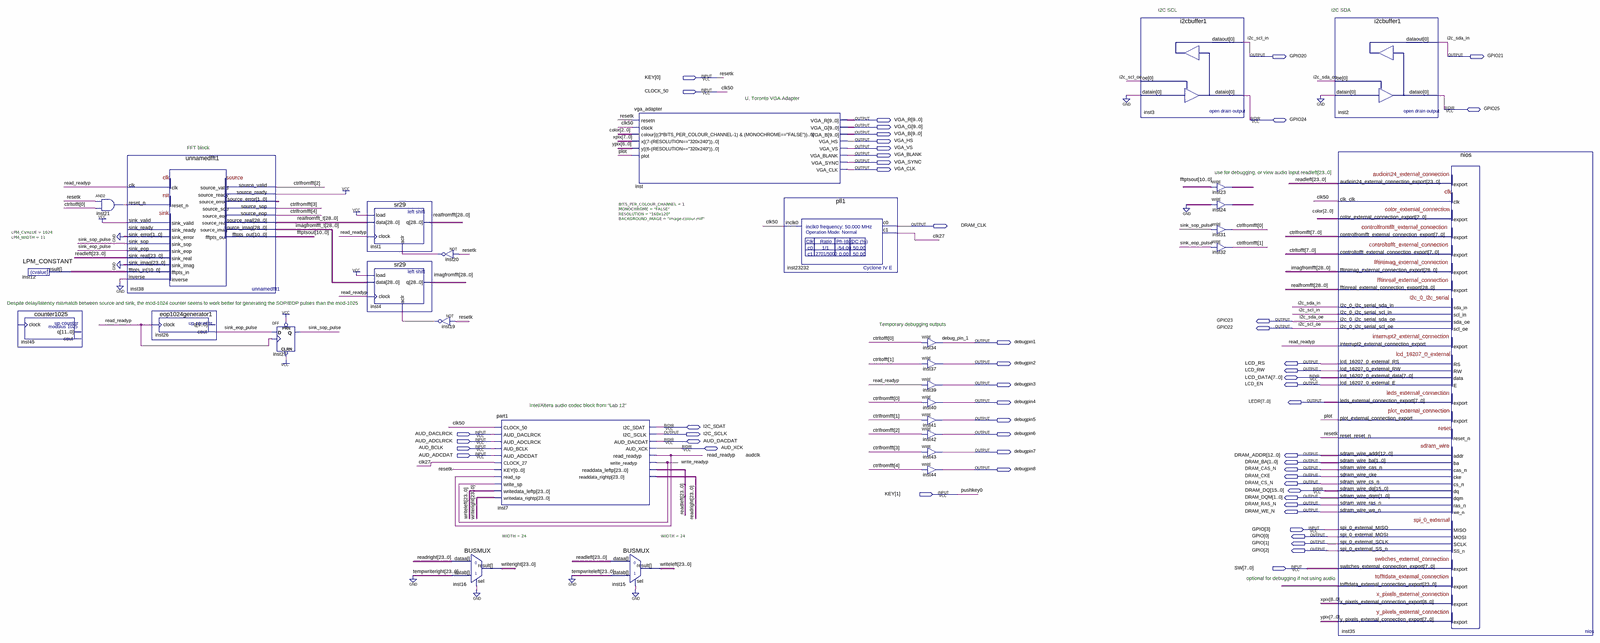
[diagram p0: schematic sheet, whole]
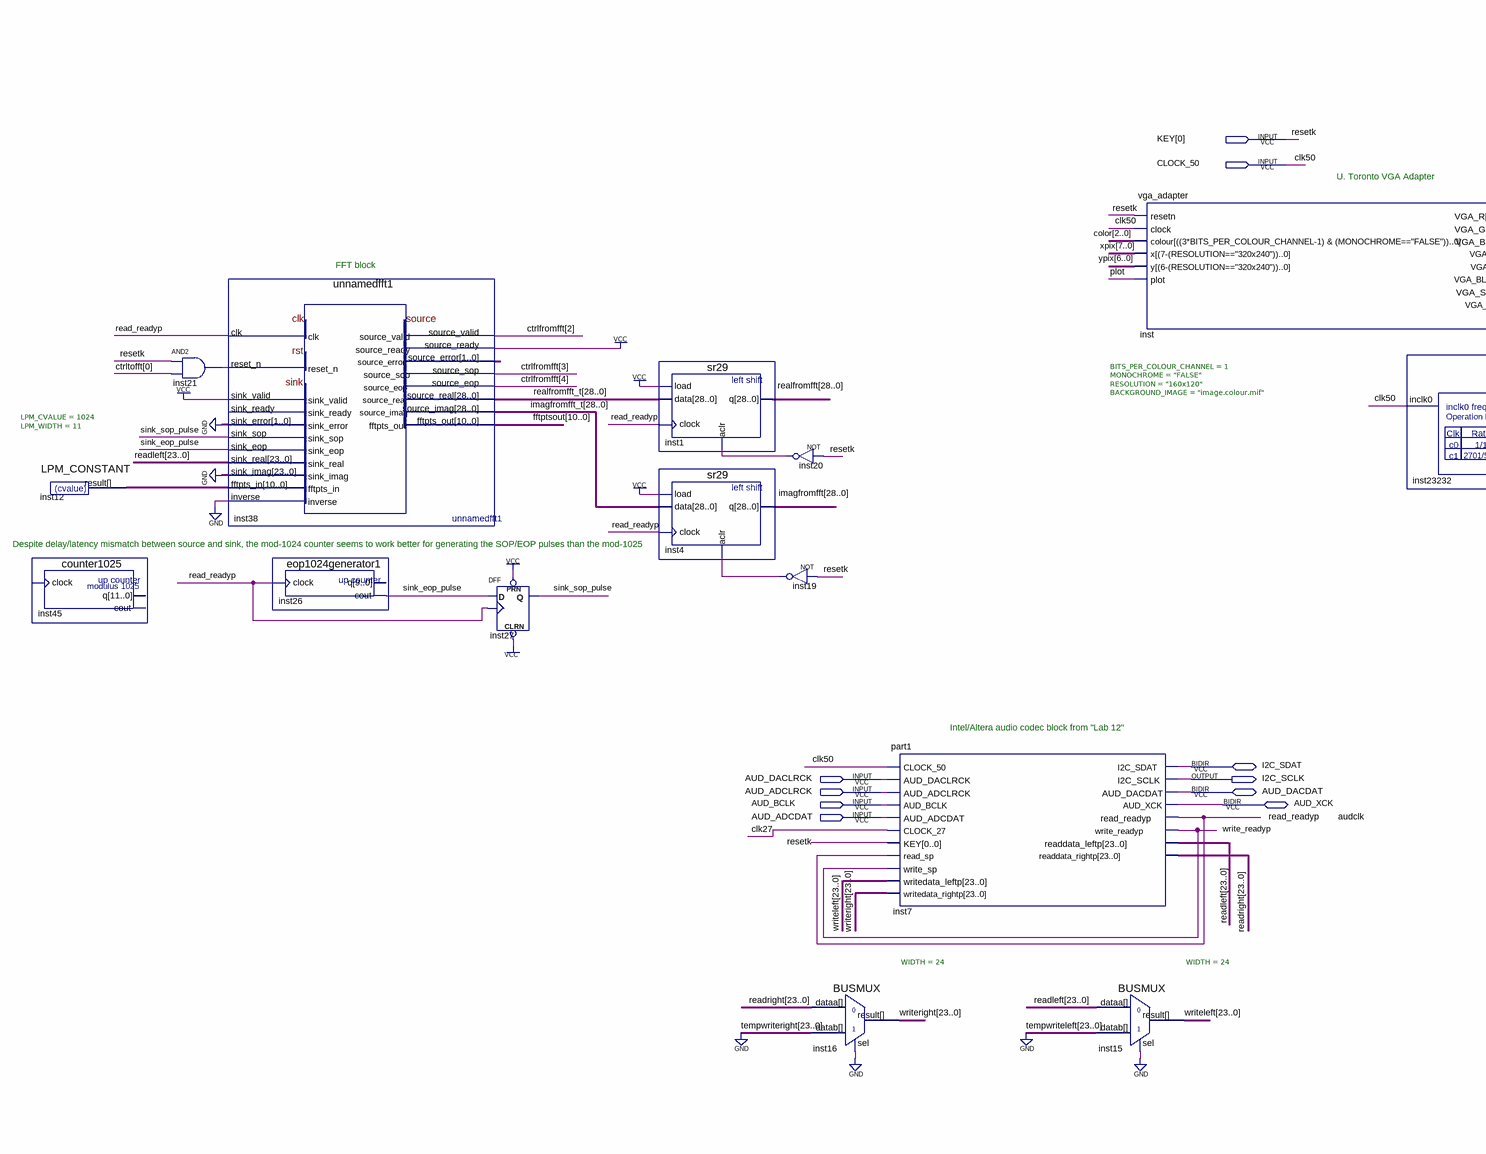
[diagram p1: schematic sheet, left part]
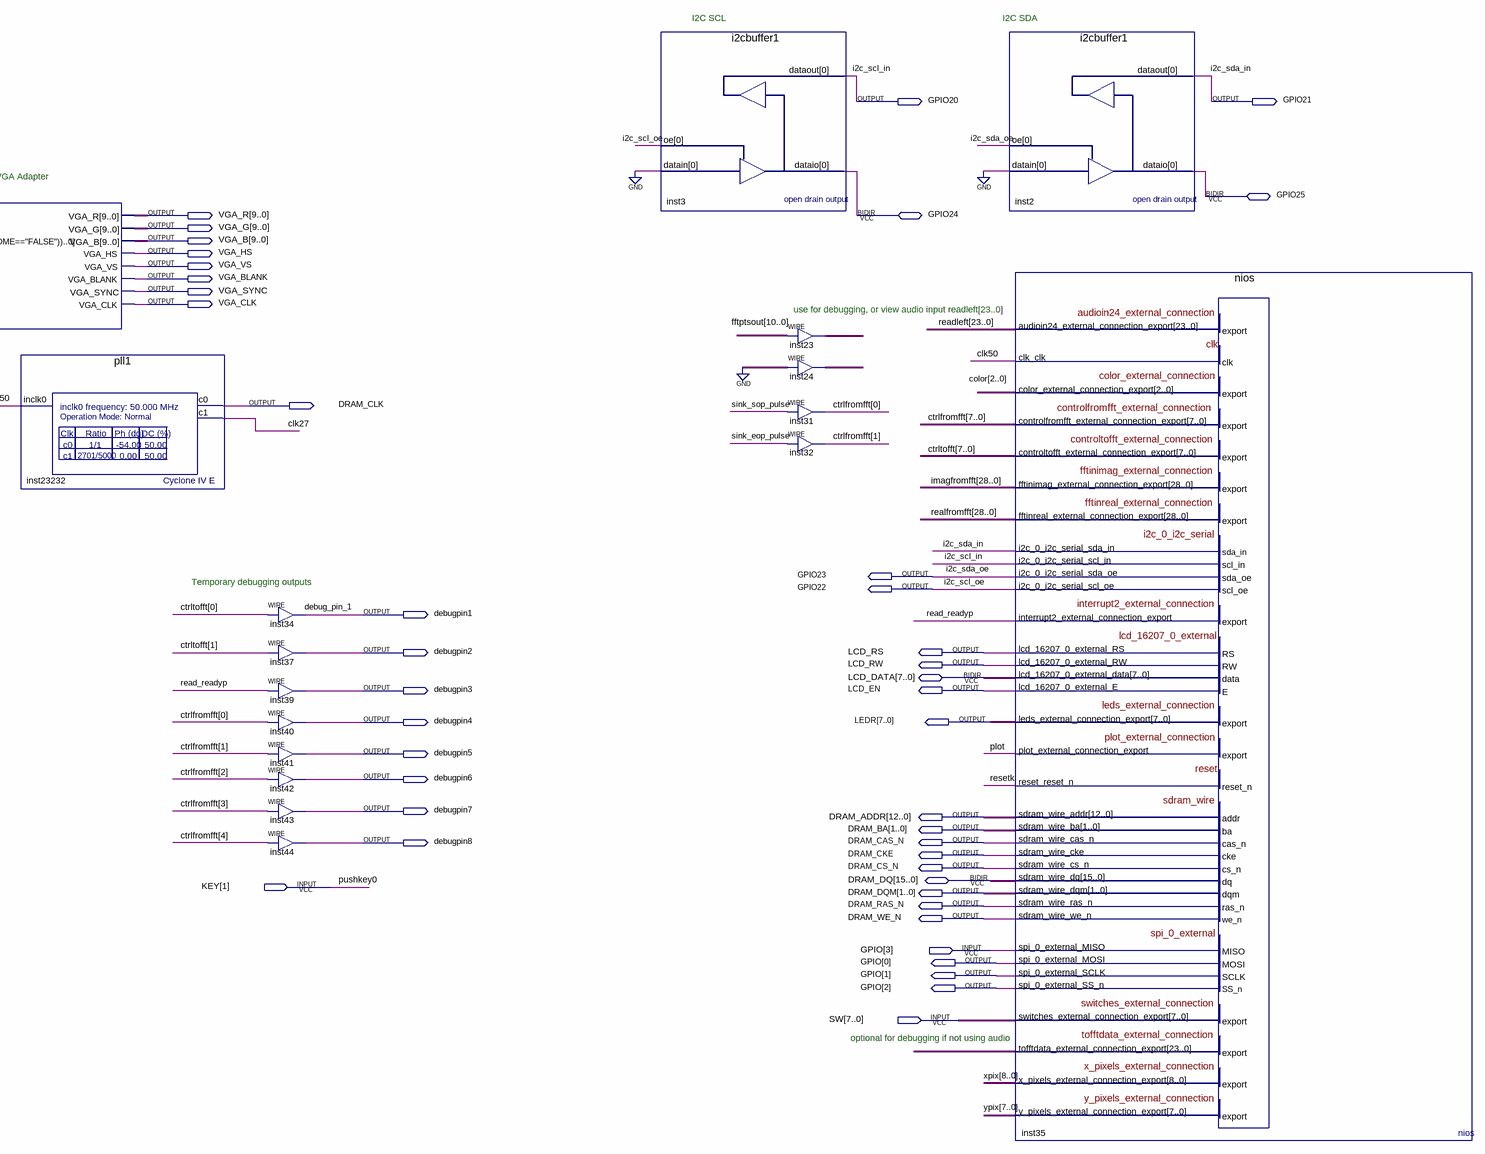
[diagram p2: schematic sheet, right part]
// Quartus schematic niosSDRAMdemoSTD1.bdf as structural Verilog: 30 symbols, 53 pins
module niosSDRAMdemoSTD1 (
  input  [1:0] KEY,
  input  CLOCK_50,
  input  AUD_DACLRCK,
  input  AUD_ADCLRCK,
  input  AUD_BCLK,
  input  AUD_ADCDAT,
  inout  [3:0] GPIO,
  input  [7:0] SW,
  inout  GPIO25,
  inout  GPIO24,
  inout  [7:0] LCD_DATA,
  inout  I2C_SDAT,
  inout  AUD_DACDAT,
  inout  AUD_XCK,
  inout  [15:0] DRAM_DQ,
  output GPIO20,
  output GPIO21,
  output [9:0] VGA_R,
  output [9:0] VGA_G,
  output [9:0] VGA_B,
  output VGA_HS,
  output VGA_VS,
  output VGA_BLANK,
  output VGA_SYNC,
  output VGA_CLK,
  output DRAM_CLK,
  output GPIO23,
  output GPIO22,
  output debugpin1,
  output debugpin2,
  output LCD_RS,
  output LCD_RW,
  output debugpin3,
  output LCD_EN,
  output debugpin4,
  output [7:0] LEDR,
  output debugpin5,
  output I2C_SCLK,
  output debugpin6,
  output debugpin7,
  output [12:0] DRAM_ADDR,
  output [1:0] DRAM_BA,
  output debugpin8,
  output DRAM_CAS_N,
  output DRAM_CKE,
  output DRAM_CS_N,
  output [1:0] DRAM_DQM,
  output DRAM_RAS_N,
  output DRAM_WE_N
);

  wire clk27, inst19_out, inst20_out, inst21_out, inst24_out, plot, read_readyp, sink_eop_pulse,
       sink_sop_pulse, write_readyp;
  wire [1:0] inst38_source_error;
  wire [2:0] color;
  wire [7:0] ctrlfromfft, ctrltofft, ypix;
  wire [8:0] xpix;
  wire [10:0] fftptsout, inst12_result, inst23_out;
  wire [23:0] inst35_tofftdata_external_connection_export, readleft, readright, writeleft, writeright;
  wire [28:0] imagfromfft, imagfromfft_t, realfromfft, realfromfft_t;

  LPM_CONSTANT #(.LPM_CVALUE(1024), .LPM_WIDTH(11)) inst12 (.result(inst12_result));
  counter1025 inst45 ();  // open: clock, cout, q
  and inst21 (inst21_out, KEY[0], ctrltofft[0]);
  unnamedfft1 inst38 (
    .clk(read_readyp), .reset_n(inst21_out), .sink_valid(1'b1), .sink_error(2'b00),
    .sink_sop(sink_sop_pulse), .sink_eop(sink_eop_pulse), .sink_real(readleft), .sink_imag({24{1'b0}}),
    .fftpts_in(inst12_result), .inverse(1'b0), .source_ready(1'b1), .source_valid(ctrlfromfft[2]),
    .source_error(inst38_source_error), .source_sop(ctrlfromfft[3]), .source_eop(ctrlfromfft[4]),
    .source_real(realfromfft_t), .source_imag(imagfromfft_t), .fftpts_out(fftptsout));  // open: sink_ready
  eop1024generator1 inst26 (.clock(read_readyp), .cout(sink_eop_pulse));  // open: q
  DFF inst27 (.CLRN(1'b1), .CLK(read_readyp), .D(sink_eop_pulse), .PRN(1'b1), .Q(sink_sop_pulse));
  sr29 inst1 (.load(1'b1), .data(realfromfft_t), .clock(read_readyp), .aclr(inst20_out), .q(realfromfft));
  sr29 inst4 (.load(1'b1), .data(imagfromfft_t), .clock(read_readyp), .aclr(inst19_out), .q(imagfromfft));
  not inst20 (inst20_out, KEY[0]);
  not inst19 (inst19_out, KEY[0]);
  BUSMUX #(.WIDTH(24)) inst16 (.datab({24{1'b0}}), .sel(1'b0), .dataa(readright), .result(writeright));
  part1 inst7 (
    .CLOCK_50(CLOCK_50), .AUD_DACLRCK(AUD_DACLRCK), .AUD_ADCLRCK(AUD_ADCLRCK), .AUD_BCLK(AUD_BCLK),
    .AUD_ADCDAT(AUD_ADCDAT), .CLOCK_27(clk27), .KEY(KEY[0]), .read_sp(read_readyp), .write_sp(write_readyp),
    .writedata_leftp(writeleft), .writedata_rightp(writeright), .I2C_SCLK(I2C_SCLK), .AUD_DACDAT(AUD_DACDAT),
    .AUD_XCK(AUD_XCK), .read_readyp(read_readyp), .write_readyp(write_readyp), .readdata_leftp(readleft),
    .readdata_rightp(readright), .I2C_SDAT(I2C_SDAT));
  BUSMUX #(.WIDTH(24)) inst15 (.datab({24{1'b0}}), .sel(1'b0), .dataa(readleft), .result(writeleft));
  vga_adapter #(.BITS_PER_COLOUR_CHANNEL(1), .MONOCHROME("FALSE"), .RESOLUTION("160x120"), .BACKGROUND_IMAGE("image.colour.mif")) inst (
    .resetn(KEY[0]), .clock(CLOCK_50), .plot(plot), .x(xpix[7:0]), .y(ypix[6:0]), .colour(color),
    .VGA_R(VGA_R), .VGA_G(VGA_G), .VGA_B(VGA_B), .VGA_HS(VGA_HS), .VGA_VS(VGA_VS), .VGA_BLANK(VGA_BLANK),
    .VGA_SYNC(VGA_SYNC), .VGA_CLK(VGA_CLK));
  pll1 inst23232 (.inclk0(CLOCK_50), .c0(DRAM_CLK), .c1(clk27));
  assign debugpin1 = ctrltofft[0];  // WIRE inst34
  assign debugpin2 = ctrltofft[1];  // WIRE inst37
  assign debugpin3 = read_readyp;  // WIRE inst39
  assign debugpin4 = ctrlfromfft[0];  // WIRE inst40
  assign debugpin5 = ctrlfromfft[1];  // WIRE inst41
  assign debugpin6 = ctrlfromfft[2];  // WIRE inst42
  assign debugpin7 = ctrlfromfft[3];  // WIRE inst43
  assign debugpin8 = ctrlfromfft[4];  // WIRE inst44
  i2cbuffer1 inst3 (.datain(1'b0), .oe(GPIO22), .dataout(GPIO20), .dataio(GPIO24));
  assign inst23_out = fftptsout;  // WIRE inst23
  assign inst24_out = 1'b0;  // WIRE inst24
  assign ctrlfromfft[0] = sink_sop_pulse;  // WIRE inst31
  assign ctrlfromfft[1] = sink_eop_pulse;  // WIRE inst32
  i2cbuffer1 inst2 (.datain(1'b0), .oe(GPIO23), .dataout(GPIO21), .dataio(GPIO25));
  nios inst35 (
    .audioin24_external_connection_export(readleft), .clk_clk(CLOCK_50),
    .controlfromfft_external_connection_export(ctrlfromfft),
    .fftinimag_external_connection_export(imagfromfft), .fftinreal_external_connection_export(realfromfft),
    .i2c_0_i2c_serial_sda_in(GPIO21), .i2c_0_i2c_serial_scl_in(GPIO20),
    .interrupt2_external_connection_export(read_readyp), .reset_reset_n(KEY[0]),
    .spi_0_external_MISO(GPIO[3]), .switches_external_connection_export(SW),
    .color_external_connection_export(color), .controltofft_external_connection_export(ctrltofft),
    .i2c_0_i2c_serial_sda_oe(GPIO23), .i2c_0_i2c_serial_scl_oe(GPIO22), .lcd_16207_0_external_RS(LCD_RS),
    .lcd_16207_0_external_RW(LCD_RW), .lcd_16207_0_external_E(LCD_EN),
    .leds_external_connection_export(LEDR), .plot_external_connection_export(plot),
    .sdram_wire_addr(DRAM_ADDR), .sdram_wire_ba(DRAM_BA), .sdram_wire_cas_n(DRAM_CAS_N),
    .sdram_wire_cke(DRAM_CKE), .sdram_wire_cs_n(DRAM_CS_N), .sdram_wire_dqm(DRAM_DQM),
    .sdram_wire_ras_n(DRAM_RAS_N), .sdram_wire_we_n(DRAM_WE_N), .spi_0_external_MOSI(GPIO[0]),
    .spi_0_external_SCLK(GPIO[1]), .spi_0_external_SS_n(GPIO[2]),
    .tofftdata_external_connection_export(inst35_tofftdata_external_connection_export),
    .x_pixels_external_connection_export(xpix), .y_pixels_external_connection_export(ypix),
    .lcd_16207_0_external_data(LCD_DATA), .sdram_wire_dq(DRAM_DQ));

  // Other names for the same wires on the sheet: audclk = AUD_XCK; clk50 = CLOCK_50; debug_pin_1 = debugpin1;
  //   i2c_scl_in = GPIO20; i2c_sda_in = GPIO21; i2c_scl_oe = GPIO22; i2c_sda_oe = GPIO23; pushkey0 = KEY[1];
  //   resetk = KEY[0]

  // Notes on the sheet:
  //   I2C SCL
  //   I2C SDA
  //   U. Toronto VGA Adapter
  //   FFT block
  //   use for debugging, or view audio input readleft[23..0]
  //   Despite delay/latency mismatch between source and sink, the mod-1024 counter seems to work better for generating the SOP/EOP pulses than the mod-1025
  //   Temporary debugging outputs
  //   Intel/Altera audio codec block from "Lab 12"
  //   optional for debugging if not using audio
endmodule
